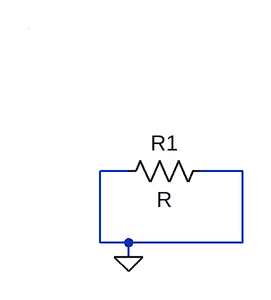
[diagram p0: schematic draft.asc]
draft.asc, the LTspice schematic file:
Version 4
SHEET 1 880 680
WIRE 112 160 80 160
WIRE 240 160 192 160
WIRE 80 240 80 160
WIRE 112 240 80 240
WIRE 240 240 240 160
WIRE 240 240 112 240
WIRE 112 256 112 240
WIRE 0 0 0 0
FLAG 112 256 0
SYMBOL res 208 144 R90
WINDOW 0 0 56 VBottom 2
WINDOW 3 32 56 VTop 2
SYMATTR InstName R1

The netlist it stands for:
* draft.asc
R1 0 0 R
.backanno
.end